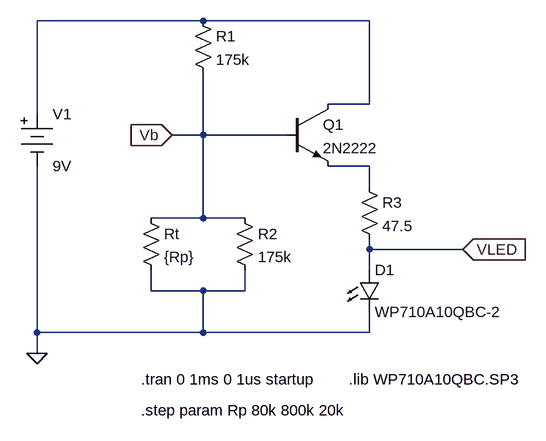
[diagram p0: schematic Thermister Design.asc]
Thermister Design.asc, the LTspice schematic file:
Version 4
SHEET 1 968 680
WIRE 464 -48 208 -48
WIRE 720 -48 464 -48
WIRE 720 80 720 -48
WIRE 720 80 656 80
WIRE 208 96 208 -48
WIRE 464 128 464 32
WIRE 464 128 416 128
WIRE 592 128 464 128
WIRE 720 176 656 176
WIRE 720 208 720 176
WIRE 464 256 464 128
WIRE 464 256 384 256
WIRE 528 256 464 256
WIRE 720 304 720 288
WIRE 864 304 720 304
WIRE 720 336 720 304
WIRE 384 368 384 336
WIRE 464 368 384 368
WIRE 528 368 528 336
WIRE 528 368 464 368
WIRE 208 432 208 176
WIRE 464 432 464 368
WIRE 464 432 208 432
WIRE 720 432 720 400
WIRE 720 432 464 432
WIRE 208 464 208 432
FLAG 208 464 0
FLAG 416 128 Vb
IOPIN 416 128 In
FLAG 864 304 VLED
IOPIN 864 304 In
SYMBOL Misc/battery 208 80 R0
SYMATTR InstName V1
SYMATTR Value 9V
SYMBOL res 448 -64 R0
SYMATTR InstName R1
SYMATTR Value 175k
SYMBOL res 512 240 R0
SYMATTR InstName R2
SYMATTR Value 175k
SYMBOL res 704 192 R0
SYMATTR InstName R3
SYMATTR Value 47.5
SYMBOL npn 592 80 R0
SYMATTR InstName Q1
SYMATTR Value 2N2222
SYMBOL res 368 240 R0
SYMATTR InstName Rt
SYMATTR Value {Rp}
SYMBOL LED 704 336 R0
SYMATTR InstName D1
SYMATTR Value WP710A10QBC-2
TEXT 368 504 Left 2 !.tran 0 1ms 0 1us startup
TEXT 368 552 Left 2 !.step param Rp 80k 800k 20k
TEXT 688 504 Left 2 !.lib WP710A10QBC.SP3

The netlist it stands for:
* Thermister Design.asc
V1 N001 0 9V
R1 N001 Vb 175k
R2 Vb 0 175k
R3 N002 VLED 47.5
Q1 N001 Vb N002 0 2N2222
Rt Vb 0 {Rp}
D1 VLED 0 WP710A10QBC-2
.model D D
.lib standard.dio
.model NPN NPN
.model PNP PNP
.lib standard.bjt
.tran 0 1ms 0 1us startup
.step param Rp 80k 800k 20k
.lib WP710A10QBC.SP3
.backanno
.end